# EAGLE design LTC3200-5 Breakout Board (EAGLE 9.6.2)
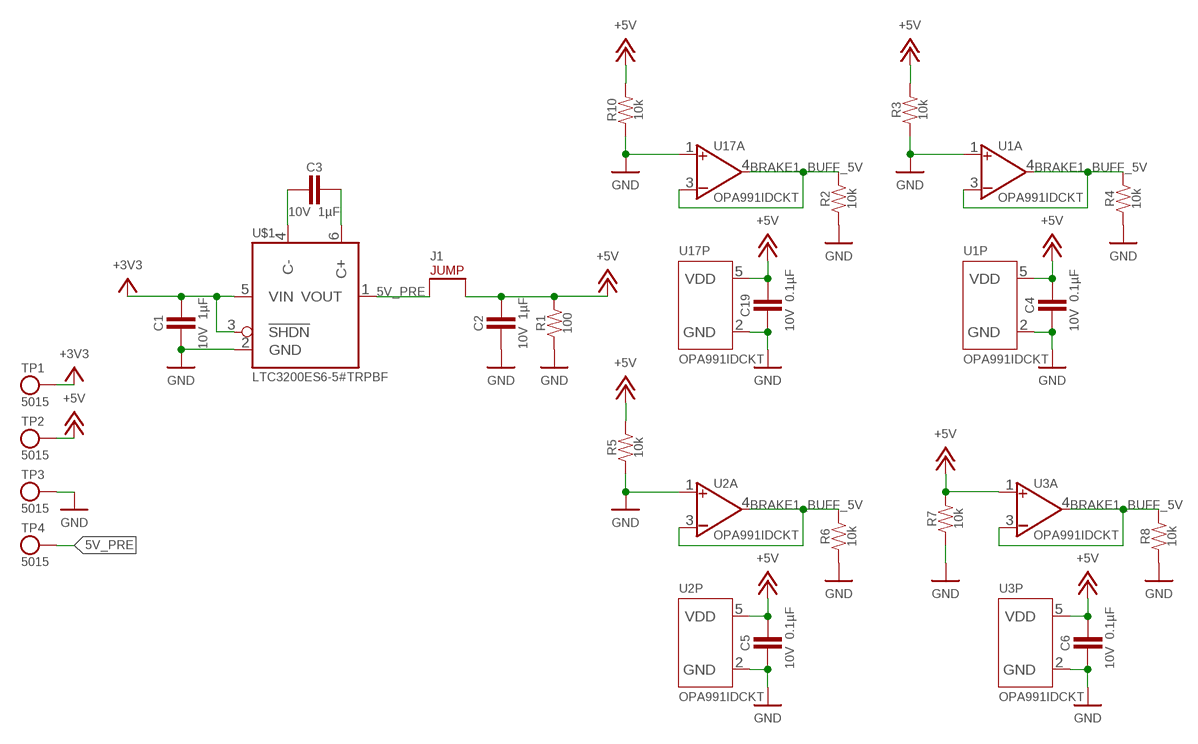
[diagram p0: schematic, sheet 1]

## Parts
C1  CAPACITOR_0603_10V_1UF  [0603-CAP]
C2  CAPACITOR_0603_10V_1UF  [0603-CAP]
C3  CAPACITOR_0603_10V_1UF  [0603-CAP]
C4  CAPACITOR_0603_10V_0.1UF  [0603-CAP]
C5  CAPACITOR_0603_10V_0.1UF  [0603-CAP]
C6  CAPACITOR_0603_10V_0.1UF  [0603-CAP]
C19  CAPACITOR_0603_10V_0.1UF  [0603-CAP]
J1  JUMPER_1X02_  [1X02]
R1  RESISTOR_0603_100  [0603-RES]
R2  RESISTOR_0603_10K  [0603-RES]
R3  RESISTOR_0603_10K  [0603-RES]
R4  RESISTOR_0603_10K  [0603-RES]
R5  RESISTOR_0603_10K  [0603-RES]
R6  RESISTOR_0603_10K  [0603-RES]
R7  RESISTOR_0603_10K  [0603-RES]
R8  RESISTOR_0603_10K  [0603-RES]
R10  RESISTOR_0603_10K  [0603-RES]
TP1  TEST_POINT  [MICRO_MINIATURE]
TP2  TEST_POINT  [MICRO_MINIATURE]
TP3  TEST_POINT  [MICRO_MINIATURE]
TP4  TEST_POINT  [MICRO_MINIATURE]
U1  OPAMP_1_CHANNEL_OPA991  [SC-70-5]
U2  OPAMP_1_CHANNEL_OPA991  [SC-70-5]
U3  OPAMP_1_CHANNEL_OPA991  [SC-70-5]
U17  OPAMP_1_CHANNEL_OPA991  [SC-70-5]
U$1  LTC3200-5  [SOT-23-6]

## Nets
5V_PRE: J1.1 TP4.1 U$1.1(VOUT)
+3V3: C1.1 TP1.1 U$1.3(!SHDN) U$1.5(VIN)
+5V: C2.1 C4.1 C5.1 C6.1 C19.1 J1.2 R1.2 R3.2 R5.2 R7.2 R10.2 TP2.1 U1.5(P:VDD) U2.5(P:VDD) U3.1(A:VIN+) U3.5(P:VDD) U17.5(P:VDD)
BRAKE1_BUFF_5V: R2.2 R4.2 R6.2 R8.2 U1.3(A:VIN-) U1.4(A:VOUT) U2.3(A:VIN-) U2.4(A:VOUT) U3.3(A:VIN-) U3.4(A:VOUT) U17.3(A:VIN-) U17.4(A:VOUT)
GND: C1.2 C2.2 C4.2 C5.2 C6.2 C19.2 R1.1 R2.1 R3.1 R4.1 R5.1 R6.1 R7.1 R8.1 R10.1 TP3.1 U1.1(A:VIN+) U1.2(P:GND) U2.1(A:VIN+) U2.2(P:GND) U3.2(P:GND) U17.1(A:VIN+) U17.2(P:GND) U$1.2(GND)
N$3: C3.2 U$1.4(C-)
N$4: C3.1 U$1.6(C+)

## Library data of the parts
C1-C3 = HyTechDevices:CAPACITOR_?_*: Capacitor, Non-Polarized VJ...1BC Series Datasheet <https://www.mouser.com/datasheet/2/427/vjw1bcbascomseries-1762447.pdf> Samsung Datasheet <https://www.mouser.com/datasheet/2/585/MLCC-1837944.pdf> Walsin Datasheet <https://www.mouser.com/datasheet/2/210/WTC_MLCC_General_Purpose-1534899.pdf> GRM188R61A226ME15D <https://www.mouser.com/datasheet/2/281/1/GRM188R61A226ME15_02A-1985787.pdf> GRM188R61E106MA73D <https://www.mouser.com/datasheet/2/281/1/GRM188R61E106MA73_01A-1985806.pdf> 885012006013 <https://www.mouser.com/datasheet/2/445/885012006013-1726946.pdf>; CAPACITANCE: 1µF; DKPN: 311-1796-1-ND; MANUFACTURER: Yageo; MOPN: 603-CC603KRX7R6BB105; MPN: CC0603KRX7R6BB105; TOLERANCE: 10%; VOLTAGE: 10V
C4-C6 C19 = HyTechDevices:CAPACITOR_?_*: Capacitor, Non-Polarized VJ...1BC Series Datasheet <https://www.mouser.com/datasheet/2/427/vjw1bcbascomseries-1762447.pdf> Samsung Datasheet <https://www.mouser.com/datasheet/2/585/MLCC-1837944.pdf> Walsin Datasheet <https://www.mouser.com/datasheet/2/210/WTC_MLCC_General_Purpose-1534899.pdf> GRM188R61A226ME15D <https://www.mouser.com/datasheet/2/281/1/GRM188R61A226ME15_02A-1985787.pdf> GRM188R61E106MA73D <https://www.mouser.com/datasheet/2/281/1/GRM188R61E106MA73_01A-1985806.pdf> 885012006013 <https://www.mouser.com/datasheet/2/445/885012006013-1726946.pdf>; CAPACITANCE: 0.1µF; DKPN: 720-1688-1-ND; MANUFACTURER: Vishay Vitramon; MOPN: 77-VJ0603Y104JXQPBC; MPN: VJ0603Y104JXQPW1BC; TOLERANCE: 5%; VOLTAGE: 10V
J1 = HyTechDevices:JUMPER_?_*: 2 Pin Connector
R1 = HyTechDevices:RESISTOR_?_*: Resistor PWR163 Series <https://www.mouser.com/datasheet/2/54/pwr163-777985.pdf> AC Series <https://www.mouser.com/datasheet/2/447/Yageo_PYu_AC_51_RoHS_L_7_1714230-1874691.pdf> PU Series <https://www.mouser.com/datasheet/2/447/PYu-PU_51_RoHS_L_6-1504619.pdf> ERA Series <https://www.mouser.com/datasheet/2/315/AOA0000C307-1149632.pdf>; DKPN: 311-100HRCT-ND; MANUFACTURER: Yageo; MOPN: 603-RC0603FR-07100RL; MPN: RC0603FR-07100RL; POWER: 0.1W; RESISTANCE: 100; TOLERANCE: 1%; VOLTAGE: 75V
R2-R8 R10 = HyTechDevices:RESISTOR_?_*: Resistor PWR163 Series <https://www.mouser.com/datasheet/2/54/pwr163-777985.pdf> AC Series <https://www.mouser.com/datasheet/2/447/Yageo_PYu_AC_51_RoHS_L_7_1714230-1874691.pdf> PU Series <https://www.mouser.com/datasheet/2/447/PYu-PU_51_RoHS_L_6-1504619.pdf> ERA Series <https://www.mouser.com/datasheet/2/315/AOA0000C307-1149632.pdf>; DKPN: 311-10.0KHRCT-ND; MANUFACTURER: Yageo; MOPN: 603-RC0603FR-0710KL; MPN: RC0603FR-0710KL; POWER: 0.1W; RESISTANCE: 10k; TOLERANCE: 1%; VOLTAGE: 75V
TP1-TP4 = HyTechDevices:TEST_POINT: Test Point; DKPN: 36-5015CT-ND; MANUFACTURER: Keystone Electronics; MOPN: 534-5015; MPN: 5015
U1-U3 U17 = HyTechDevices:OPAMP_1_CHANNEL_*: Op-Amp 1 Channel OPA991 Datasheet <https://www.ti.com/lit/ds/symlink/opa991.pdf?ts=1615503614502> Note: OPA991 is also a comparator; MPN: OPA991IDCKT
U$1 = HyTechDevices:LTC3200-5: LTC3200-5 Datasheet <https://www.analog.com/media/en/technical-documentation/data-sheets/32005f.pdf> Produces a regulated output voltage from a 2.7V to 4.5V input with up to 100mA of output current *Notes: - Flying capacitors connected to pins 4 (C-) and 6 (C+) must have at least 0.68 uF of capacitance in order to achieve the rated output current - Pins 1 (Vin) and 5 (Vout) both need to be bypassed with capacitors with capacitance >=0.47 uF - Pins 5 (Vout) and 3 (!SHDN) should have connected inputs; DKPN: LTC3200ES6-5#TRPBFTR-ND; MANUFACTURER: Analog Devices Inc.; MOPN: 584-C3200ES6-5TRPBF; MPN: LTC3200ES6-5#TRPBF

## Board
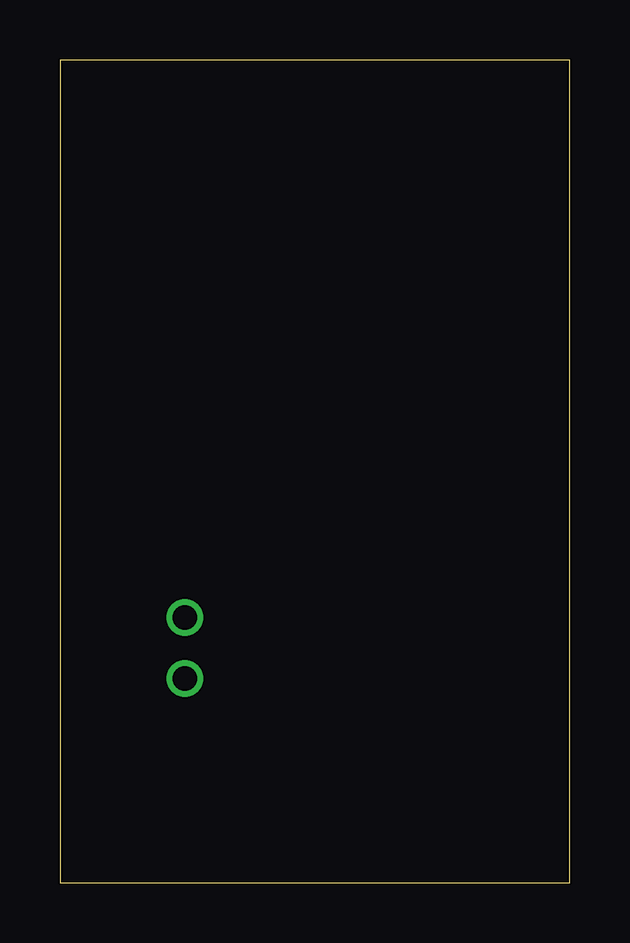
[diagram p1: board, top side]
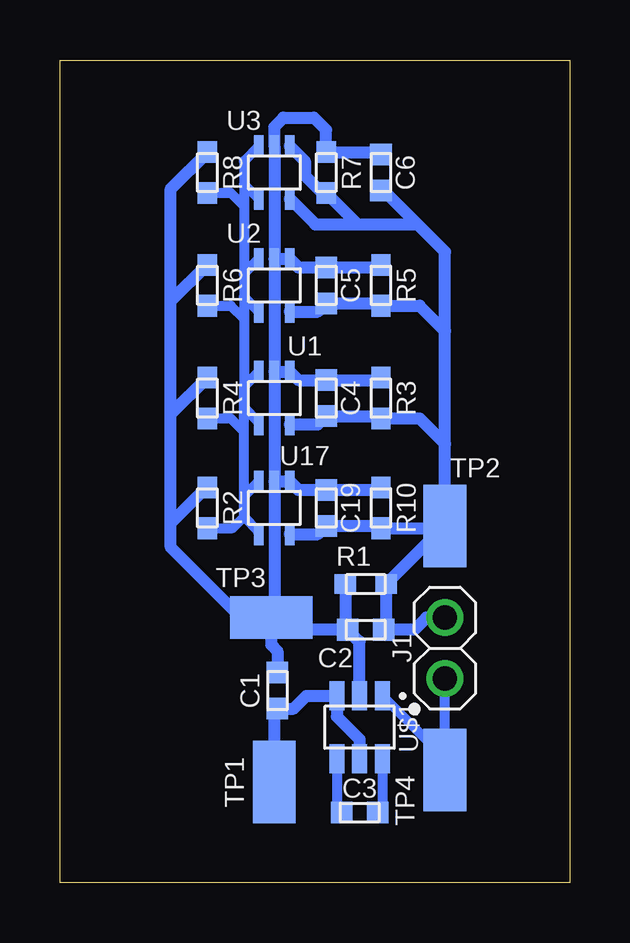
[diagram p2: board, bottom side, seen from below]

Size 21.26 x 34.28 mm. Coordinates in mm from the lower left corner, seen from the top.
Outline: 0,0 21.26,0 21.26,34.28 0,34.28 0,0
Copper layers 16: Bottom 0.035mm
Design rules "On Campus (1 Layer)": minimum track width 16mil, minimum drill 0.8mm, track to track 16mil, track to pad 12mil, pad to pad 16mil, via to via 16mil, smd to smd 10mil, copper to edge 40mil, drill to drill 10mil, minimum pad ring 10mil, minimum via ring 8mil, stop-mask expansion 4mil, vias tented up to drill 0mil, thermal gap 10mil

### Footprints (pad centres in the part's own frame; a part is rotated, then mirrored left to right if it is on the bottom)
0603-CAP = smd 0.9 x 0.9: 1 -0.75,0; 2 0.75,0
1X02 = drill 1.016: 1 -1.27,0; 2 1.27,0
0603-RES = smd 0.9 x 0.8: 1 -0.85,0; 2 0.85,0
MICRO_MINIATURE = smd 3.429 x 1.778: 1 0,0
SC-70-5 = smd 0.4 x 0.9: 1 -0.65,-1.1; 2 0,-1.1; 3 0.65,-1.1; 4 0.65,1.1; 5 -0.65,1.1
SOT-23-6 = smd 0.62 x 1.22: 1 -0.95,-1.31; 2 0,-1.31; 3 0.95,-1.31; 4 -0.95,1.31; 5 0,1.31; 6 0.95,1.31

### Placement (x,y rotation side)
C1  12.19,8 90 bottom
C2  8.51,10.54 180 bottom
C3  8.76,2.92 0 bottom
C4  10.16,20.19 90 bottom
C5  10.16,24.89 90 bottom
C6  7.87,29.59 90 bottom
C19  10.16,15.62 90 bottom
J1  5.21,9.78 90 bottom
R1  8.51,12.45 0 bottom
R2  15.11,15.62 270 bottom
R3  7.87,20.19 270 bottom
R4  15.11,20.19 270 bottom
R5  7.87,24.89 270 bottom
R6  15.11,24.89 270 bottom
R7  10.16,29.59 270 bottom
R8  15.11,29.59 270 bottom
R10  7.87,15.62 270 bottom
TP1  12.32,4.19 90 bottom
TP2  5.21,14.86 90 bottom
TP3  12.45,11.05 0 bottom
TP4  5.21,4.7 90 bottom
U1  12.32,20.19 180 bottom
U2  12.32,24.89 180 bottom
U3  12.32,29.59 180 bottom
U17  12.32,15.62 180 bottom
U$1  8.76,6.48 180 bottom

### Tracks (layer width: path | path; a pad name or v marks a point on that pad's centre or on a via)
5V_PRE
  Bottom 0.406: U$1.1 5.21,5.18 TP4.1 J1.1
+3V3
  Bottom 0.508: TP1.1 12.32,7.12 C1.1 11.52,7.25 10.98,7.79 U$1.3 9.71,6.92 8.76,5.97 U$1.5
+5V
  Bottom 0.508: J1.2 5.98,11.05 6.49,10.54 C2.1 7.66,10.64 R1.2 5.25,14.86 TP2.1 | TP2.1 5.29,14.77 R10.2 7.97,14.87 C19.1 10.51,14.52 U17.5 | TP2.1 5.21,18.29 | 5.21,18.29 5.21,22.99 | 5.21,22.99 5.21,26.29 6.35,27.43 | 5.21,22.99 6.26,24.04 R5.2 7.97,24.14 C5.1 10.51,23.79 U2.5 | 5.21,18.29 6.26,19.34 R3.2 7.97,19.44 C4.1 10.51,19.09 U1.5 | U3.5 10.61,27.43 8.85,27.43 | 8.85,27.43 6.35,27.43 | 6.35,27.43 7.76,28.84 C6.1 | 8.85,27.43 R7.2 10.33,28.74 11.05,29.46 11.05,30.07 U3.1
BRAKE1_BUFF_5V
  Bottom 0.406: U3.3 13.59,30.07 13.59,29.08 | U3.4 13.56,29.08 13.59,29.08 | 13.59,24.41 U2.4 | U2.3 13.59,25.37 | 13.59,25.37 13.59,24.41 | U1.3 13.59,20.67 | 13.59,19.81 13.59,20.67 | U1.4 12.97,19.19 13.59,19.81 | U17.3 13.59,16.1 | 13.59,15.24 13.59,16.1 | U17.4 12.97,14.62 13.59,15.24 | 13.59,29.08 13.59,28.19 | 13.59,28.19 13.59,25.37 | 13.59,24.41 13.59,23.5 | 13.59,23.5 13.59,20.67 | 13.59,16.1 13.59,18.8 | 13.59,18.8 13.59,19.81 | R2.2 14.06,14.77 13.59,15.24 | R4.2 14.14,19.34 13.59,18.8 | R6.2 14.14,24.04 13.59,23.5 | R8.2 14.14,28.74 13.59,28.19
GND
  Bottom 0.406: 9.36,10.64 C2.2
  Bottom 0.508: R1.1 9.36,10.64 | U$1.2 8.76,10.04 C2.2 11.94,10.54 TP3.1 | C1.2 12.19,9.65 12.45,9.91 TP3.1 | TP3.1 12.45,11.18 12.32,11.3 U17.2 | C6.2 7.97,30.44 R7.1 10.16,31.37 10.67,31.88 11.94,31.88 12.32,31.5 U3.2 U2.2 | U2.2 U1.2 | U1.2 U17.2 | U2.2 U2.1 11.32,25.64 C5.2 7.97,25.64 R5.1 | U1.2 U1.1 11.32,20.94 C4.2 7.97,20.94 R3.1 | U17.2 U17.1 11.32,16.37 C19.2 7.97,16.37 R10.1 | TP3.1 13.72,11.05 16.64,13.97 16.64,14.99 | 16.64,14.99 16.64,19.52 | 16.64,19.52 16.64,24.22 | 16.64,24.22 16.64,28.92 R8.1 | R6.1 16.64,24.22 | R4.1 16.64,19.52 | R2.1 15.15,16.47 16.64,14.99
N$3
  Bottom 0.406: U$1.4 7.81,3.12 C3.2
N$4
  Bottom 0.406: U$1.6 9.71,3.12 C3.1